# Altium project top.PrjPcb
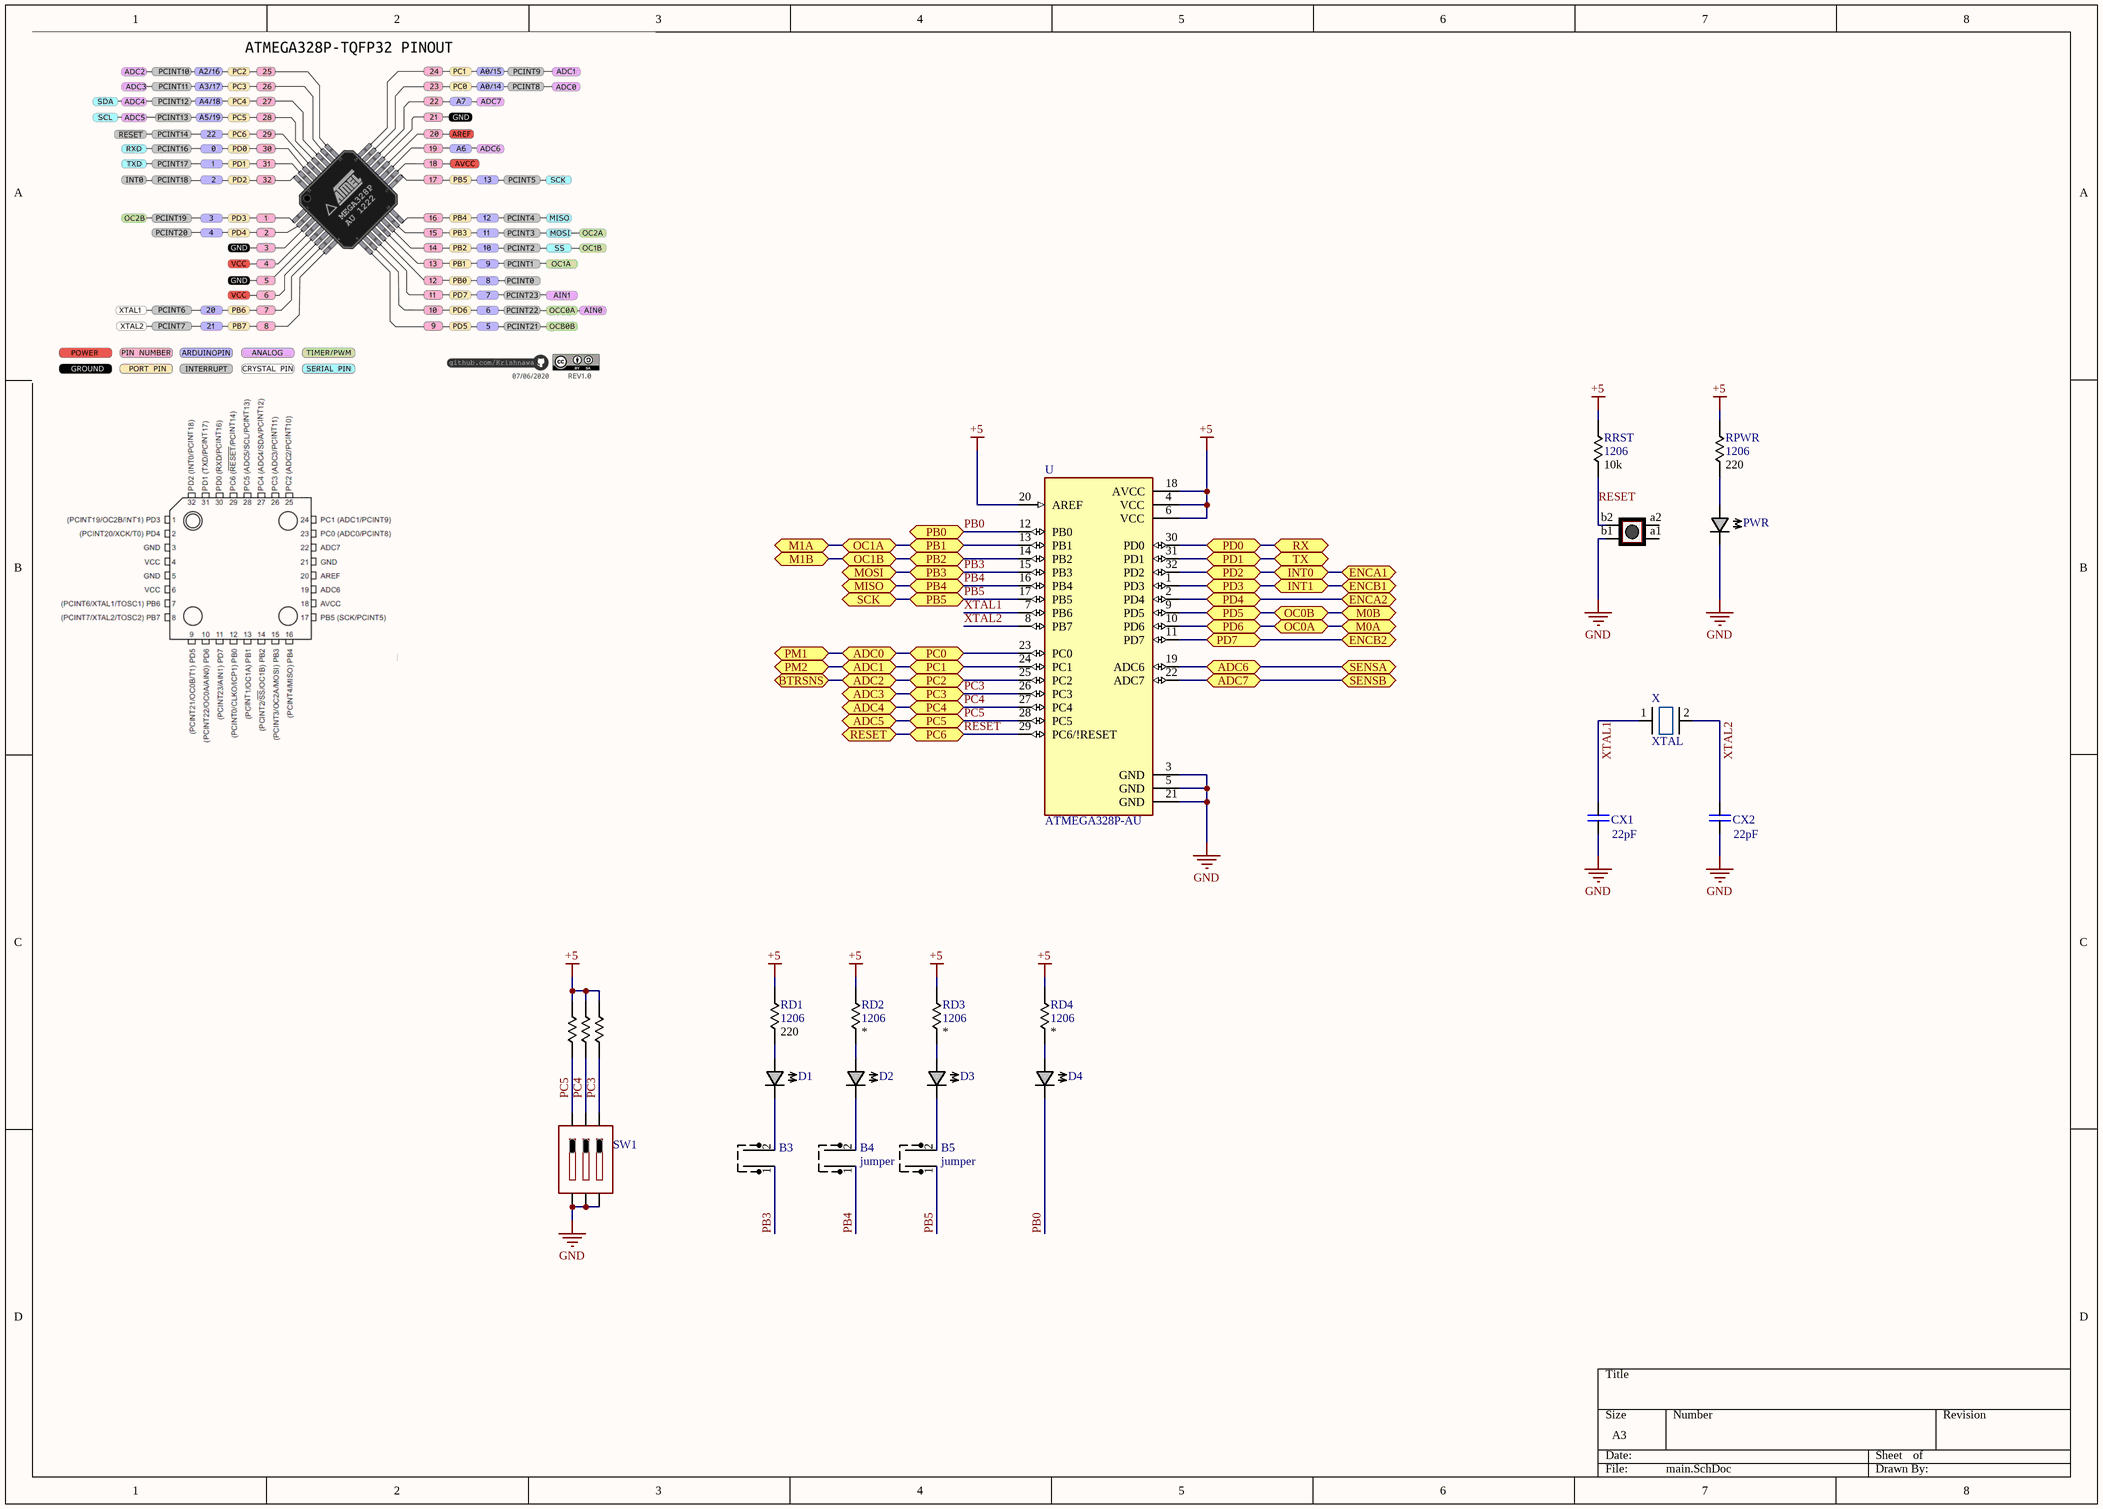
[diagram p0: main.SchDoc]
1 sheet, 23 parts. Net scope: flat (ports and power ports of the same name join across sheets).
Board files: main.PcbDoc, test_board.PcbDoc

## Sheet main.SchDoc
size A3

### Parts
B3  jumper  [JUMPER2]  (value not drawn)
B4  jumper  [JUMPER2]
B5  jumper  [JUMPER2]
CX1  value 22pF  [cap100]  (hidden comment: cap disk)
CX2  value 22pF  [cap100]  (hidden comment: cap disk)
D1  3.2x1.6  [LED3_2X1_6]  (value not drawn)
D2  3.2x1.6  [LED3_2X1_6]  (value not drawn)
D3  3.2x1.6  [LED3_2X1_6]  (value not drawn)
D4  3.2x1.6  [LED3_2X1_6]  (value not drawn)
PWR  3.2x1.6  [LED3_2X1_6]  (value not drawn)
RD1  1206  value 220  [1206]
RD2  1206  [1206]
RD3  1206  [1206]
RD4  1206  [1206]
RPWR  1206  value 220  [1206]
RRST  1206  value 10k  [1206]
RST_SW  button  [push_button]  (value not drawn)
RSW1  1206  [1206]  (value not drawn)
RSW2  1206  [1206]  (value not drawn)
RSW3  1206  [1206]  (value not drawn)
SW1  dipsw3  [PCBComponent_1]  (value not drawn)
U  ATMEGA328P-AU  [QFP80P900X900X120-32N]
X  XTAL  [XTAL1]

### Ports
ADC0 (bidir), ADC1 (bidir), ADC2 (bidir), ADC3 (bidir), ADC4 (bidir), ADC5 (bidir), ADC6 (bidir), ADC7 (bidir), BTRSNS (bidir), ENCA1 (bidir), ENCA2 (bidir), ENCB1 (bidir), ENCB2 (bidir), INT0 (bidir), INT1 (bidir), M0A (bidir), M0B (bidir), M1A (bidir), M1B (bidir), MISO (bidir), MOSI (bidir), OC0A (bidir), OC0B (bidir), OC1A (bidir), OC1B (bidir), PB0 (bidir), PB1 (bidir), PB2 (bidir), PB3 (bidir), PB4 (bidir), PB5 (bidir), PC0 (bidir), PC1 (bidir), PC2 (bidir), PC3 (bidir), PC4 (bidir), PC5 (bidir), PC6 (bidir), PD0 (bidir), PD1 (bidir), PD2 (bidir), PD3 (bidir), PD4 (bidir), PD5 (bidir), PD6 (bidir), PD7 (bidir), PM1 (bidir), PM2 (bidir), RESET (bidir), RX (bidir), SCK (bidir), SENSA (bidir), SENSB (bidir), TX (bidir)

### Nets
+5: RD1.2 RD2.2 RD3.2 RD4.2 RPWR.2 RRST.2 RSW1.2 RSW2.2 RSW3.2 U.4(VCC) U.6(VCC) U.18(AVCC) U.20(AREF)
GND: CX1.1 CX2.1 PWR.C RST_SW.b1 SW1.4 SW1.5 SW1.6 U.3(GND) U.5(GND) U.21(GND)
PB0: D4.C U.12(PB0) ; port PB0
PB3: B3.1 U.15(PB3) ; port PB3, port MOSI
PB4: B4.1 U.16(PB4) ; port PB4, port MISO
PB5: B5.1 U.17(PB5) ; port PB5, port SCK
PC3: RSW3.1 SW1.1 U.26(PC3) ; port PC3, port ADC3
PC4: RSW2.1 SW1.2 U.27(PC4) ; port PC4, port ADC4
PC5: RSW1.1 SW1.3 U.28(PC5) ; port PC5, port ADC5
RESET: RRST.1 RST_SW.b2 U.29(PC6/!RESET) ; port PC6, port RESET
XTAL1: CX1.2 U.7(PB6) X.1
XTAL2: CX2.2 U.8(PB7) X.2
NetB3_2: B3.2 D1.C
NetB4_2: B4.2 D2.C
NetB5_2: B5.2 D3.C
NetD1_A: D1.A RD1.1
NetD2_A: D2.A RD2.1
NetD3_A: D3.A RD3.1
NetD4_A: D4.A RD4.1
NetPWR_A: PWR.A RPWR.1
NetU_1: U.1(PD3) ; port PD3, port INT1, port ENCB1
NetU_2: U.2(PD4) ; port PD4, port ENCA2
NetU_9: U.9(PD5) ; port PD5, port OC0B, port M0B
NetU_10: U.10(PD6) ; port PD6, port OC0A, port M0A
NetU_11: U.11(PD7) ; port PD7, port ENCB2
NetU_13: U.13(PB1) ; port PB1, port OC1A, port M1A
NetU_14: U.14(PB2) ; port PB2, port OC1B, port M1B
NetU_19: U.19(ADC6) ; port ADC6, port SENSA
NetU_22: U.22(ADC7) ; port ADC7, port SENSB
NetU_23: U.23(PC0) ; port PC0, port ADC0, port PM1
NetU_24: U.24(PC1) ; port PC1, port ADC1, port PM2
NetU_25: U.25(PC2) ; port PC2, port ADC2, port BTRSNS
NetU_30: U.30(PD0) ; port PD0, port RX
NetU_31: U.31(PD1) ; port PD1, port TX
NetU_32: U.32(PD2) ; port PD2, port INT0, port ENCA1

Not connected (* = marked no-connect by the designer): RST_SW a1 a2

### Library data of the parts
B3-B5 = Jumper_2
CX1 CX2 = C?
D1-D4 PWR = led
RSW1-RSW3 = 1206: Value: 10k
U = ATMEGA328P-AU: AVR AVRÂ® ATmega Microcontroller IC 8-Bit 20MHz 32KB _16K x 16_ FLASH 32-TQFP _7x7_; MF: Microchip; Value: *; SnapEDA_Link: https://www.snapeda.com/parts/ATMEGA328P-AU/Microchip/view-part/44280/?ref=snap; MP: ATMEGA328P-AU; Availability: Unavailable; Price: None; Package: TQFP-32 Microchip
RD1-RD4 RPWR RRST = 1206
  RD2-RD4: Value: *